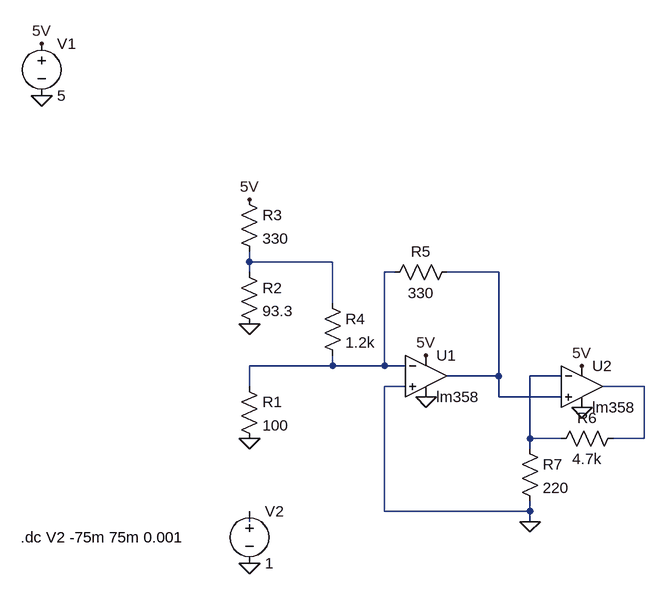
[diagram p0: schematic volvo-schematic.asc]
volvo-schematic.asc, the LTspice schematic file:
Version 4
SHEET 1 880 680
WIRE -64 0 -64 -16
WIRE 64 0 -64 0
WIRE -64 16 -64 0
WIRE 160 16 144 16
WIRE 320 16 240 16
WIRE 64 64 64 0
WIRE 64 160 64 144
WIRE 64 160 -64 160
WIRE 144 160 144 16
WIRE 144 160 64 160
WIRE 176 160 144 160
WIRE 320 176 320 16
WIRE 320 176 240 176
WIRE 416 176 368 176
WIRE -64 192 -64 160
WIRE 176 192 144 192
WIRE 544 192 480 192
WIRE 320 208 320 176
WIRE 416 208 320 208
WIRE 368 272 368 176
WIRE 416 272 368 272
WIRE 544 272 544 192
WIRE 544 272 496 272
WIRE 368 288 368 272
WIRE 144 384 144 192
WIRE 368 384 368 368
WIRE 368 384 144 384
WIRE -64 400 -64 384
WIRE 368 400 368 384
FLAG 368 400 0
FLAG 208 208 0
FLAG 448 224 0
FLAG -64 96 0
FLAG 448 160 5V
FLAG 208 144 5V
FLAG -64 -96 5V
FLAG -384 -336 5V
FLAG -384 -256 0
FLAG -64 464 0
FLAG -64 272 0
SYMBOL res -80 176 R0
SYMATTR InstName R1
SYMATTR Value 100
SYMBOL res -80 0 R0
SYMATTR InstName R2
SYMATTR Value 93.3
SYMBOL res -80 -112 R0
SYMATTR InstName R3
SYMATTR Value 330
SYMBOL res 48 48 R0
SYMATTR InstName R4
SYMATTR Value 1.2k
SYMBOL res 256 0 R90
WINDOW 0 0 56 VBottom 2
WINDOW 3 32 56 VTop 2
SYMATTR InstName R5
SYMATTR Value 330
SYMBOL res 400 288 R270
WINDOW 0 32 56 VTop 2
WINDOW 3 0 56 VBottom 2
SYMATTR InstName R6
SYMATTR Value 4.7k
SYMBOL res 352 272 R0
SYMATTR InstName R7
SYMATTR Value 220
SYMBOL OpAmps\\lm358 208 112 R0
SYMATTR InstName U1
SYMBOL OpAmps\\lm358 448 128 R0
SYMATTR InstName U2
SYMBOL voltage -384 -352 R0
WINDOW 123 0 0 Left 0
WINDOW 39 0 0 Left 0
SYMATTR InstName V1
SYMATTR Value 5
SYMBOL voltage -64 368 R0
WINDOW 123 0 0 Left 0
WINDOW 39 0 0 Left 0
SYMATTR InstName V2
SYMATTR Value 1
TEXT -416 424 Left 2 !.dc V2 -75m 75m 0.001

The netlist it stands for:
* volvo-schematic.asc
R1 N002 0 100
R2 N001 0 93.3
R3 5V N001 330
R4 N001 N002 1.2k
R5 N003 N002 330
R6 N004 N005 4.7k
R7 N004 0 220
XU1 0 N002 5V 0 N003 lm358  ; pins In+ In- V+ V- OUT
XU2 N003 N004 5V 0 N005 lm358  ; pins In+ In- V+ V- OUT
V1 5V 0 5
V2 N006 0 1
.dc V2 -75m 75m 0.001
.backanno
.end